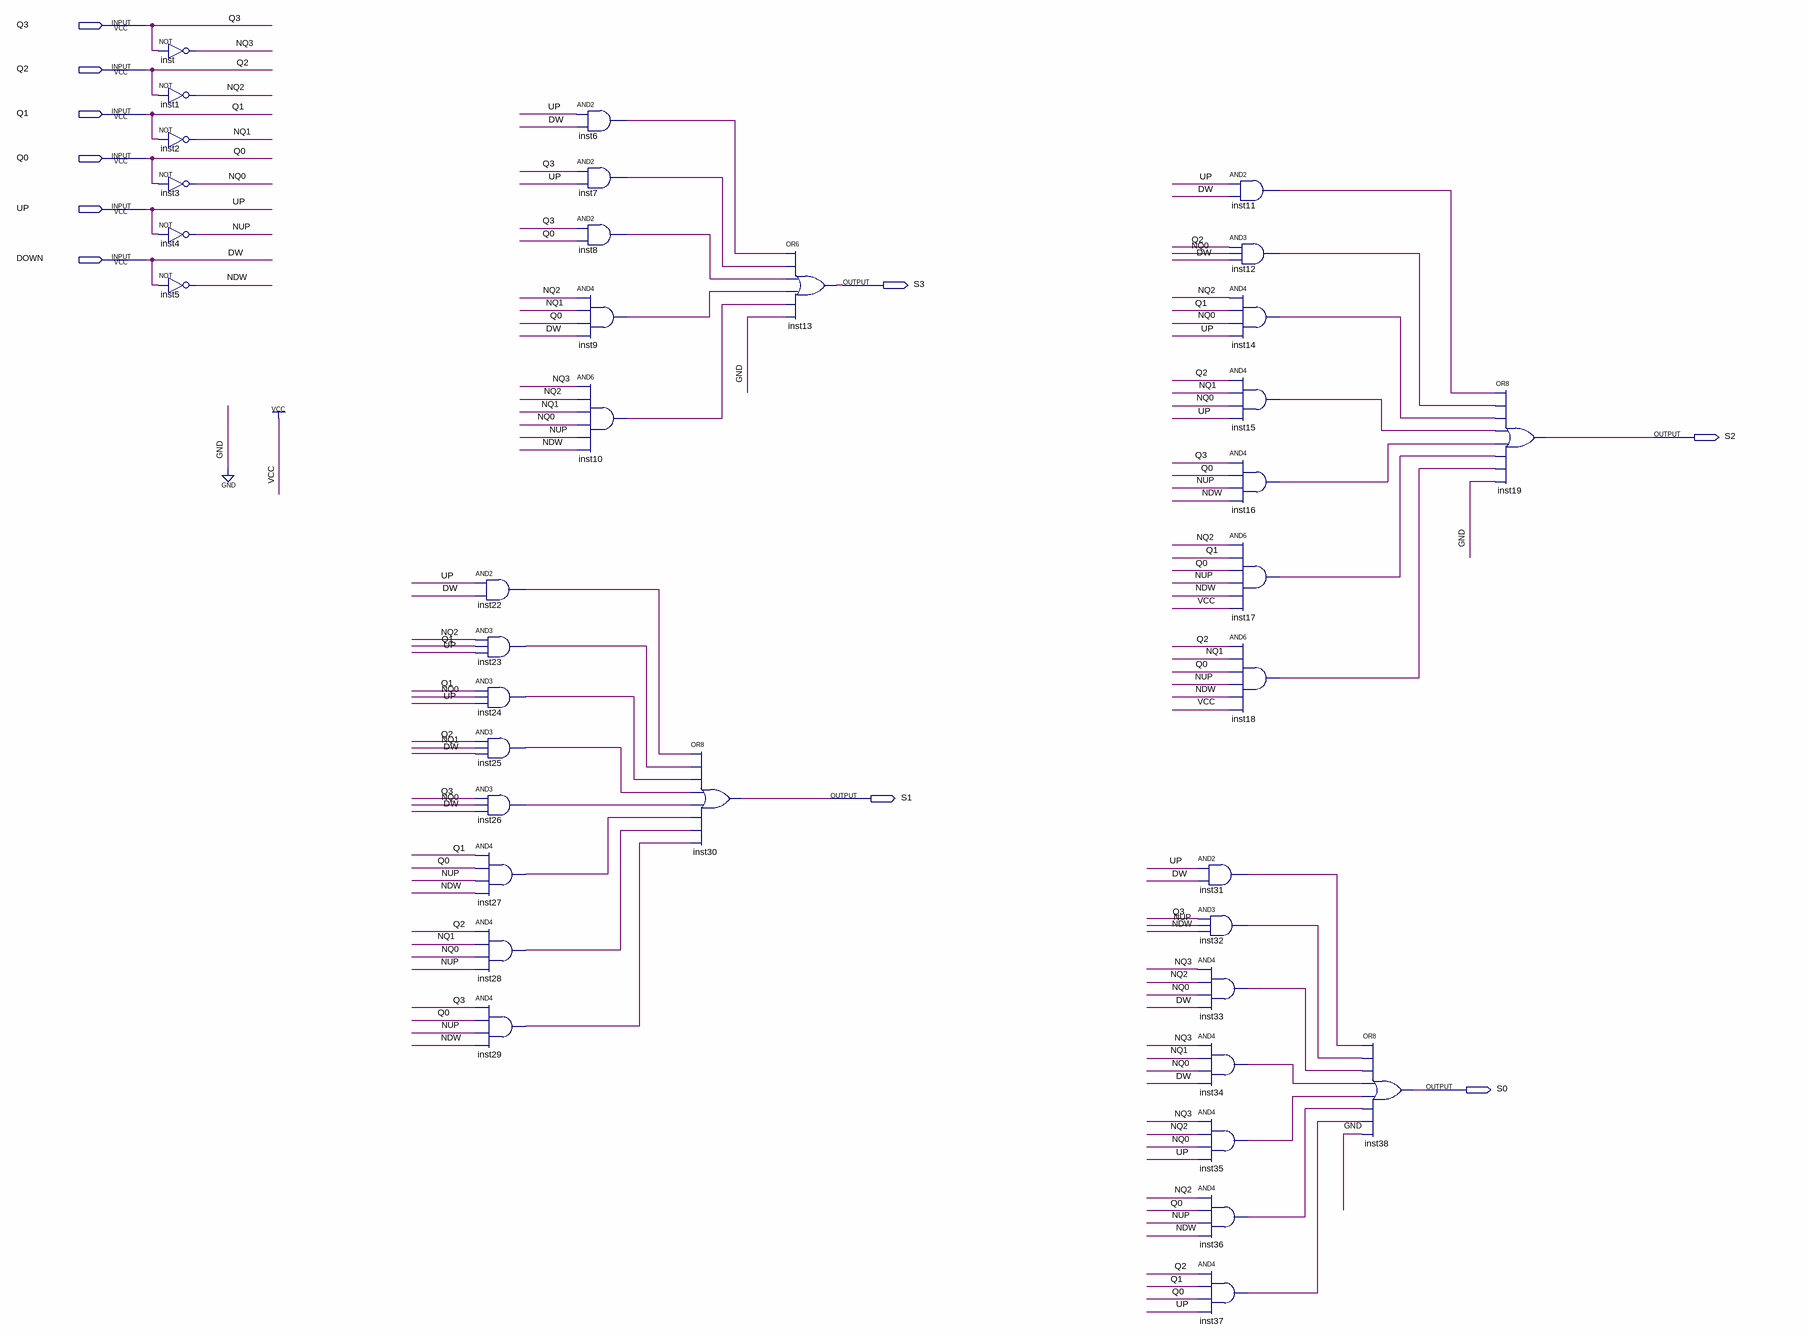
[diagram p0: schematic sheet]
// Quartus schematic CC2.bdf as structural Verilog: 37 symbols, 10 pins
module CC2 (
  input  Q3,
  input  Q2,
  input  Q1,
  input  Q0,
  input  UP,
  input  DOWN,
  output S3,
  output S2,
  output S1,
  output S0
);

  wire inst6_out, inst7_out, inst8_out, inst9_out, inst10_out, inst11_out, inst12_out, inst14_out,
       inst15_out, inst16_out, inst17_out, inst18_out, inst22_out, inst23_out, inst24_out, inst25_out,
       inst26_out, inst27_out, inst28_out, inst29_out, inst31_out, inst32_out, inst33_out, inst34_out,
       inst35_out, inst36_out, inst37_out, NDW, NQ0, NQ1, NQ2, NQ3, NUP;

  not inst (NQ3, Q3);
  not inst1 (NQ2, Q2);
  not inst2 (NQ1, Q1);
  not inst3 (NQ0, Q0);
  not inst4 (NUP, UP);
  not inst5 (NDW, DOWN);
  and inst22 (inst22_out, UP, DOWN);
  and inst23 (inst23_out, NQ2, Q1, UP);
  and inst24 (inst24_out, Q1, NQ0, UP);
  and inst25 (inst25_out, Q2, NQ1, DOWN);
  and inst26 (inst26_out, Q3, NQ0, DOWN);
  and inst27 (inst27_out, Q1, Q0, NUP, NDW);
  and inst28 (inst28_out, Q2, NQ1, NQ0, NUP);
  and inst29 (inst29_out, Q3, Q0, NUP, NDW);
  and inst6 (inst6_out, UP, DOWN);
  and inst7 (inst7_out, Q3, UP);
  and inst8 (inst8_out, Q3, Q0);
  and inst9 (inst9_out, NQ2, NQ1, Q0, DOWN);
  and inst10 (inst10_out, NQ3, NQ2, NQ1, NQ0, NUP, NDW);
  or inst30 (S1, inst22_out, inst23_out, inst24_out, inst25_out, inst26_out, inst27_out, inst28_out, inst29_out);
  or inst13 (S3, inst6_out, inst7_out, inst8_out, inst9_out, inst10_out, 1'b0);
  and inst31 (inst31_out, UP, DOWN);
  and inst32 (inst32_out, Q3, NUP, NDW);
  and inst33 (inst33_out, NQ3, NQ2, NQ0, DOWN);
  and inst34 (inst34_out, NQ3, NQ1, NQ0, DOWN);
  and inst35 (inst35_out, NQ3, NQ2, NQ0, UP);
  and inst36 (inst36_out, NQ2, Q0, NUP, NDW);
  and inst37 (inst37_out, Q2, Q1, Q0, UP);
  and inst11 (inst11_out, UP, DOWN);
  and inst12 (inst12_out, Q2, NQ0, DOWN);
  and inst14 (inst14_out, NQ2, Q1, NQ0, UP);
  and inst15 (inst15_out, Q2, NQ1, NQ0, UP);
  and inst16 (inst16_out, Q3, Q0, NUP, NDW);
  and inst17 (inst17_out, NQ2, Q1, Q0, NUP, NDW, 1'b1);
  and inst18 (inst18_out, Q2, NQ1, Q0, NUP, NDW, 1'b1);
  or inst38 (S0, inst31_out, inst32_out, inst33_out, inst34_out, inst35_out, inst36_out, inst37_out, 1'b0);
  or inst19 (S2, inst11_out, inst12_out, inst14_out, inst15_out, inst16_out, inst17_out, inst18_out, 1'b0);

  // Other names for the same wires on the sheet: DW = DOWN
endmodule
